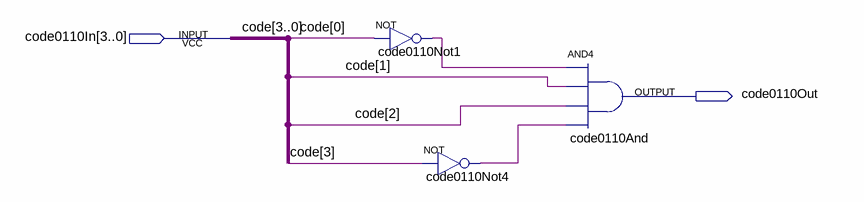
[diagram p0: schematic sheet]
// Quartus schematic code0110.bdf as structural Verilog: 3 symbols, 2 pins
module code0110 (
  input  [3:0] code0110In,
  output code0110Out
);

  wire code0110Not1_out, code0110Not4_out;

  not code0110Not1 (code0110Not1_out, code0110In[0]);
  not code0110Not4 (code0110Not4_out, code0110In[3]);
  and code0110And (code0110Out, code0110Not1_out, code0110In[1], code0110In[2], code0110Not4_out);

  // Other names for the same wires on the sheet: code[3:0] = code0110In
endmodule
